# Altium schematic sheet Phase.SchDoc
size 431 x 279 mm; SheetNumber: 3; SheetTotal: 4
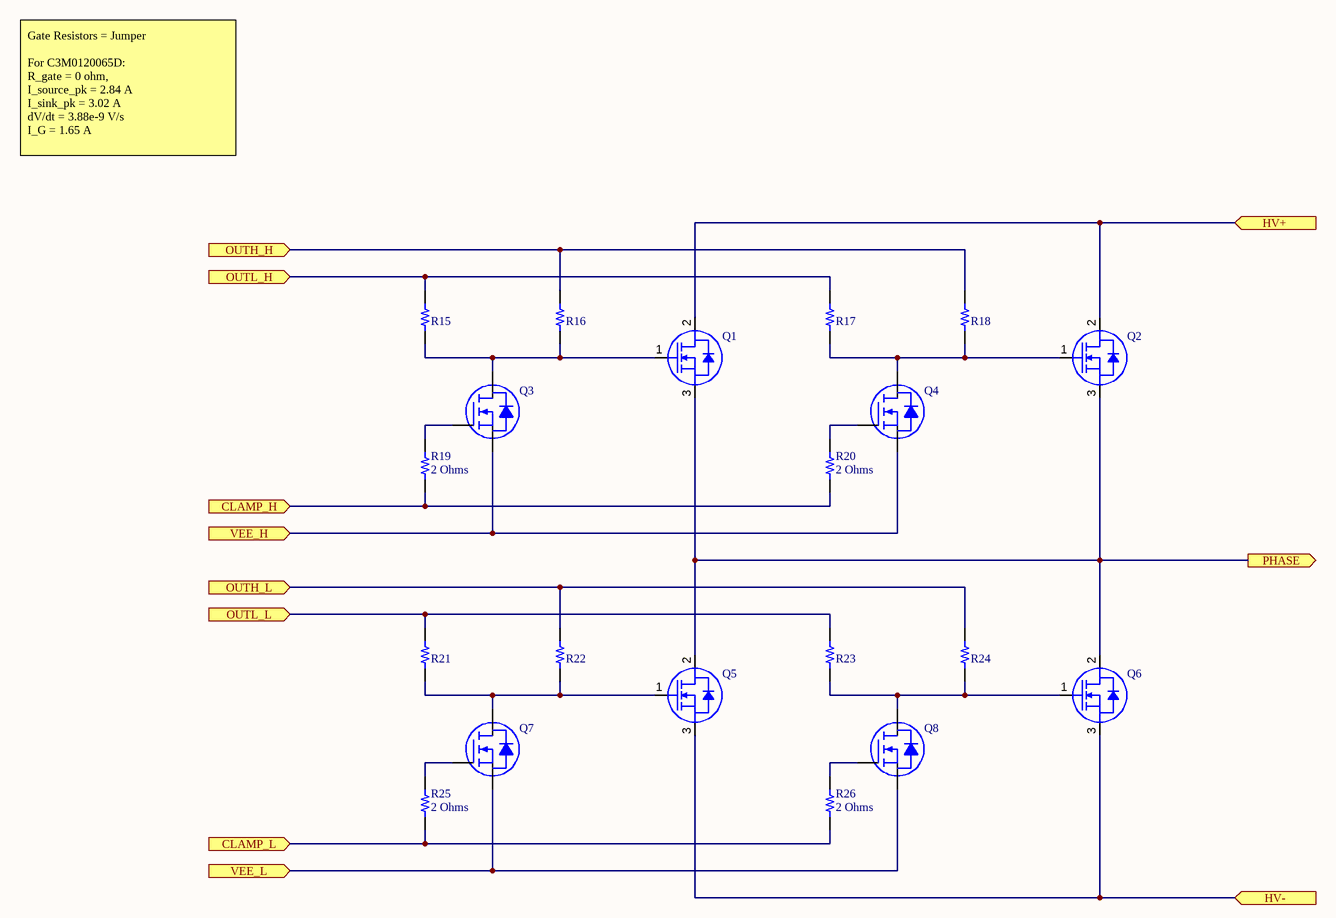
[diagram p0: Phase.SchDoc]

## Parts
Q1  C3M0120065D  (value not drawn)
Q2  C3M0120065D  (value not drawn)
Q3  IRFML8244TRPBF  [INFINEON SOT-23-3]  (value not drawn)
Q4  IRFML8244TRPBF  [INFINEON SOT-23-3]  (value not drawn)
Q5  C3M0120065D  (value not drawn)
Q6  C3M0120065D  (value not drawn)
Q7  IRFML8244TRPBF  [INFINEON SOT-23-3]  (value not drawn)
Q8  IRFML8244TRPBF  [INFINEON SOT-23-3]  (value not drawn)
R15  (no value)  [RES 0805_2012]
R16  (no value)  [RES 0805_2012]
R17  (no value)  [RES 0805_2012]
R18  (no value)  [RES 0805_2012]
R19  2 Ohms  [RES 0805_2012]
R20  2 Ohms  [RES 0805_2012]
R21  (no value)  [RES 0805_2012]
R22  (no value)  [RES 0805_2012]
R23  (no value)  [RES 0805_2012]
R24  (no value)  [RES 0805_2012]
R25  2 Ohms  [RES 0805_2012]
R26  2 Ohms  [RES 0805_2012]

## Ports
CLAMP_H (in), CLAMP_L (in), HV+ (in), HV- (in), OUTH_H (in), OUTH_L (in), OUTL_H (in), OUTL_L (in), PHASE (out), VEE_H (in), VEE_L (in)

## Nets
CLAMP_H: R19.1 R20.1 ; port CLAMP_H
CLAMP_L: R25.1 R26.1 ; port CLAMP_L
HV+: Q1.2(DRAIN) Q2.2(DRAIN) ; port HV+
HV-: Q5.3(SOURCE) Q6.3(SOURCE) ; port HV-
OUTH_H: R16.1 R18.1 ; port OUTH_H
OUTH_L: R22.1 R24.1 ; port OUTH_L
OUTL_H: R15.1 R17.1 ; port OUTL_H
OUTL_L: R21.1 R23.1 ; port OUTL_L
PHASE: Q1.3(SOURCE) Q2.3(SOURCE) Q5.2(DRAIN) Q6.2(DRAIN) ; port PHASE
VEE_H: Q3.2(S) Q4.2(S) ; port VEE_H
VEE_L: Q7.2(S) Q8.2(S) ; port VEE_L
NetQ1_1: Q1.1(GATE) Q3.3(D) R15.2 R16.2
NetQ2_1: Q2.1(GATE) Q4.3(D) R17.2 R18.2
NetQ3_1: Q3.1(G) R19.2
NetQ4_1: Q4.1(G) R20.2
NetQ5_1: Q5.1(GATE) Q7.3(D) R21.2 R22.2
NetQ6_1: Q6.1(GATE) Q8.3(D) R23.2 R24.2
NetQ7_1: Q7.1(G) R25.2
NetQ8_1: Q8.1(G) R26.2

## Notes on the sheet
- Gate Resistors = Jumper
  For C3M0120065D:
  R_gate = 0 ohm,
  I_source_pk = 2.84 A
  I_sink_pk = 3.02 A
  dV/dt = 3.88e-9 V/s
  I_G = 1.65 A
- Title
- Project
- Scale
- Size
- B
- Part Number
- Engineer
- Sheet
- of
- Rev

## Library data of the parts
Q1 Q2 Q5 Q6 = C3M0120065D: N-Channel 650 V 22A (Tc) 98W (Tc) Through Hole TO-247-3
Q3 Q4 Q7 Q8 = IRFML8244TRPBF: MOSFET N-CH 25V 5.8A SOT23; Manufacturer: Infineon Technologies; Current - Continuous Drain (Id) @ 25°C: 5.8A (Ta); Drive Voltage (Max Rds On,  Min Rds On): 4.5V, 10V; FET Type: N-Channel; Gate Charge (Qg) (Max) @ Vgs: 5.4nC @ 10V; Input Capacitance (Ciss) (Max) @ Vds: 430pF @ 10V; Power Dissipation (Max): 1.25W (Ta); Rds On (Max) @ Id, Vgs: 24mOhm @ 5.8A, 10V; Vgs (Max): ±20V; Vgs(th) (Max) @ Id: 2.35V @ 10µA; Part Number: IRFML8244TRPBF; ComponentLink1Description: Datasheet; ComponentLink1URL: https://www.infineon.com/dgdl/irfml8244pbf.pdf?fileId=5546d462533600a40153562817c91fc0; ComponentLink2Description: DigiKey Link; ComponentLink2URL: http://digikey.com/product-detail/en/infineon-technologies/IRFML8244TRPBF/IRFML8244TRPBFCT-ND/2538166; Drain to Source Voltage (Vdss): 25V; LastUpdated: 9/2/2020 1:25:05 AM; Lifecycle Status: Active; Minimum Order: 1; Mounting Type: Surface Mount; Operating Temperature: -55°C ~ 150°C (TJ); Package / Case: TO-236-3, SC-59, SOT-23-3; Packaging: TapeAndReel; Part Status: Active; Price: 0.10; Series: HEXFET®; Supplier 1: DigiKey; Supplier Part Number 1: IRFML8244TRPBFCT-ND; Supplier Device Package: SOT-23; Technology: MOSFET (Metal Oxide)
R15-R18 R21-R24 = 5107: RES 0 OHM JUMPER 0805; Part Number: 5107; Manufacturer: Keystone Electronics; Power (Watts): 0.5W, 1/2W; ComponentLink1Description: Datasheet; ComponentLink1URL: http://www.keyelco.com/product-pdf.cfm?p=14350; ComponentLink2Description: DigiKey Link; ComponentLink2URL: http://digikey.com/product-detail/en/keystone-electronics/5107/36-5107CT-ND/7942984; Composition: Metal Element; Device Package: 0805 (2012 Metric); Height - Seated (Max): 0.033" (0.84mm); LastUpdated: 9/2/2020 1:14:45 AM; Lifecycle Status: Active; Minimum Order: 1; Number of Terminations: 2; Package / Case: 0805 (2012 Metric); Packaging: TapeAndReel; PartId: 45276; Part Status: Active; Price: 0.16; Series: -; Size / Dimension: 0.079" L x 0.049" W (2.00mm x 1.25mm); Supplier 1: DigiKey; Supplier Part Number 1: 36-5107CT-ND; Supplier Device Package: 0805; Tolerance: Jumper
R19 R20 R25 R26 = CRCW08052R00JNEA: RES SMD 2 OHM 5% 1/8W 0805; Manufacturer: Vishay Dale; Power (Watts): 0.125W, 1/8W; Temperature Coefficient: ±200ppm/°C; Part Number: CRCW08052R00JNEA; Value: 2 Ohms; ComponentLink1Description: Datasheet; ComponentLink1URL: http://www.vishay.com/docs/20035/dcrcwe3.pdf; ComponentLink2Description: DigiKey Link; ComponentLink2URL: http://digikey.com/product-detail/en/vishay-dale/CRCW08052R00JNEA/541-2.0ACT-ND/1180275; Composition: Thick Film; Device Package: 0805 (2012 Metric); Features: Automotive AEC-Q200; Height - Seated (Max): 0.020" (0.50mm); LastUpdated: 9/2/2020 1:14:42 AM; Lifecycle Status: Active; Minimum Order: 1; Number of Terminations: 2; Operating Temperature: -55°C ~ 155°C; Package / Case: 0805 (2012 Metric); Packaging: CutTape; PartId: 46488; Part Status: Active; Price: 0.10; Ratings: AEC-Q200; Resistance: 2 Ohms; Series: CRCW; Size / Dimension: 0.079" L x 0.049" W (2.00mm x 1.25mm); Supplier 1: DigiKey; Supplier Part Number 1: 541-2.0ACT-ND; Supplier Device Package: 0805; Tolerance: ±5%